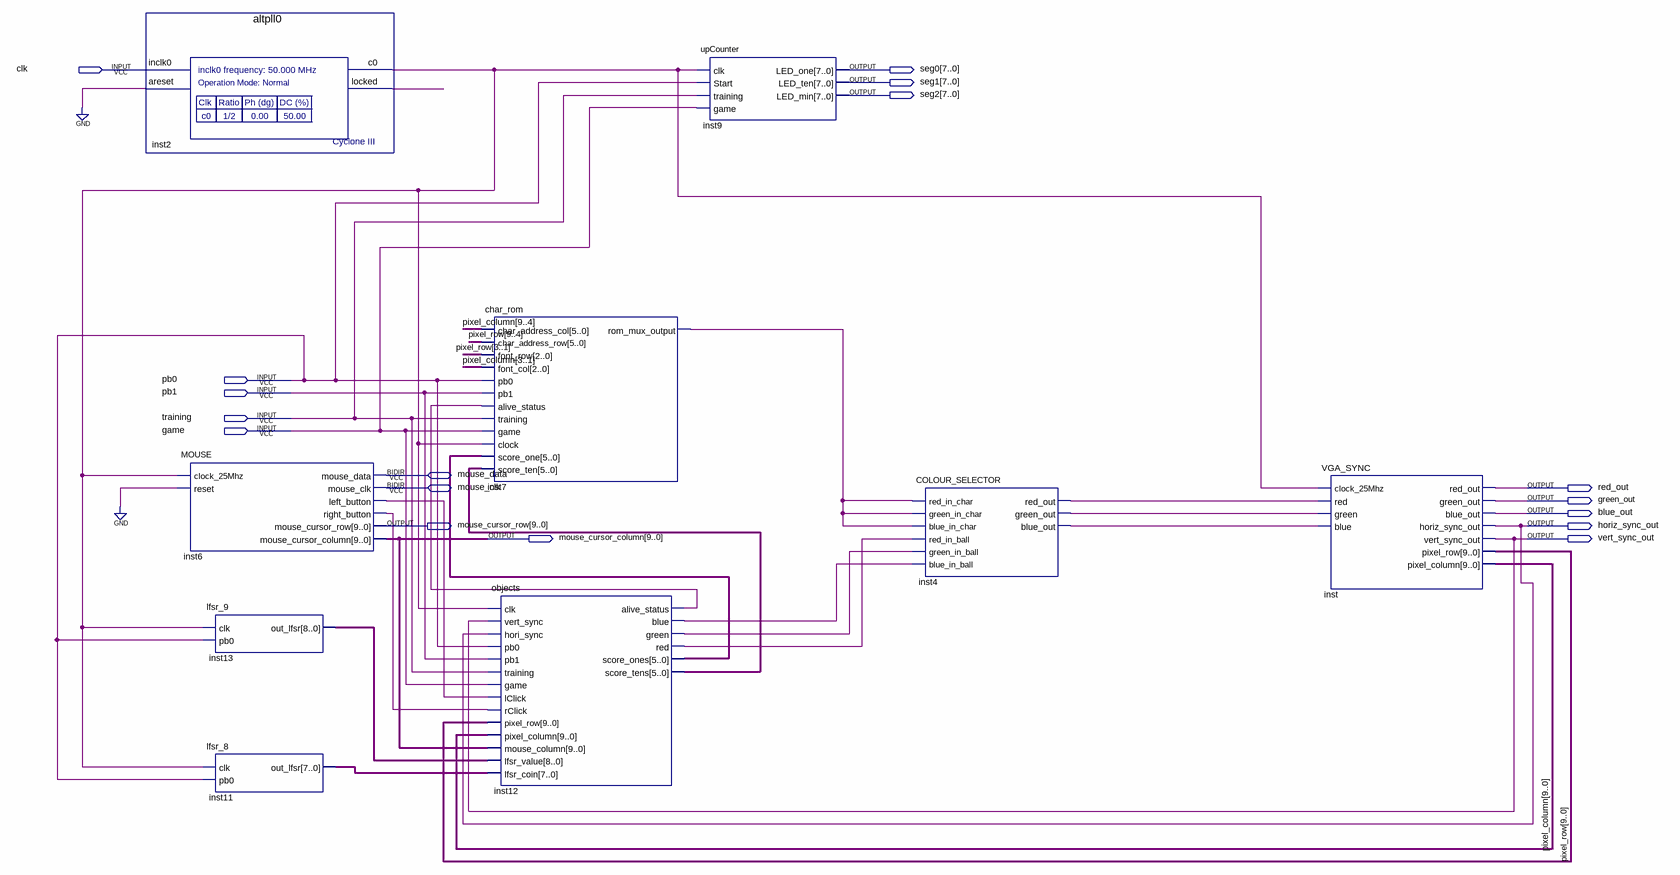
[diagram p0: schematic sheet]
// Quartus schematic miniProject.bdf as structural Verilog: 9 symbols, 17 pins
module miniProject (
  input  clk,
  input  pb0,
  input  pb1,
  input  training,
  input  game,
  inout  mouse_data,
  inout  mouse_clk,
  output [7:0] seg0,
  output [7:0] seg1,
  output [7:0] seg2,
  output red_out,
  output green_out,
  output blue_out,
  output [9:0] mouse_cursor_row,
  output horiz_sync_out,
  output [9:0] mouse_cursor_column,
  output vert_sync_out
);

  wire inst2_c0, inst2_locked, inst4_blue_out, inst4_green_out, inst4_red_out, inst6_left_button,
       inst6_right_button, inst7_rom_mux_output, inst12_alive_status, inst12_blue, inst12_green, inst12_red;
  wire [5:0] inst12_score_ones, inst12_score_tens;
  wire [7:0] inst11_out_lfsr;
  wire [8:0] inst13_out_lfsr;
  wire [9:0] pixel_column, pixel_row;

  altpll0 inst2 (.inclk0(clk), .areset(1'b0), .c0(inst2_c0), .locked(inst2_locked));
  MOUSE inst6 (
    .clock_25Mhz(inst2_c0), .reset(1'b0), .left_button(inst6_left_button), .right_button(inst6_right_button),
    .mouse_cursor_row(mouse_cursor_row), .mouse_cursor_column(mouse_cursor_column), .mouse_data(mouse_data),
    .mouse_clk(mouse_clk));
  lfsr_9 inst13 (.clk(inst2_c0), .pb0(pb0), .out_lfsr(inst13_out_lfsr));
  lfsr_8 inst11 (.clk(inst2_c0), .pb0(pb0), .out_lfsr(inst11_out_lfsr));
  char_rom inst7 (
    .char_address_col(pixel_column[9:4]), .char_address_row(pixel_row[9:4]), .font_row(pixel_row[3:1]),
    .font_col(pixel_column[3:1]), .pb0(pb0), .pb1(pb1), .alive_status(inst12_alive_status),
    .training(training), .game(game), .clock(inst2_c0), .score_one(inst12_score_ones),
    .score_ten(inst12_score_tens), .rom_mux_output(inst7_rom_mux_output));
  objects inst12 (
    .clk(inst2_c0), .vert_sync(vert_sync_out), .hori_sync(horiz_sync_out), .pb0(pb0), .pb1(pb1),
    .training(training), .game(game), .lClick(inst6_left_button), .rClick(inst6_right_button),
    .pixel_row(pixel_row), .pixel_column(pixel_column), .mouse_column(mouse_cursor_column),
    .lfsr_value(inst13_out_lfsr), .lfsr_coin(inst11_out_lfsr), .alive_status(inst12_alive_status),
    .blue(inst12_blue), .green(inst12_green), .red(inst12_red), .score_ones(inst12_score_ones),
    .score_tens(inst12_score_tens));
  upCounter inst9 (
    .clk(inst2_c0), .Start(pb0), .training(training), .game(game), .LED_one(seg0), .LED_ten(seg1),
    .LED_min(seg2));
  COLOUR_SELECTOR inst4 (
    .red_in_char(inst7_rom_mux_output), .green_in_char(inst7_rom_mux_output),
    .blue_in_char(inst7_rom_mux_output), .red_in_ball(inst12_red), .green_in_ball(inst12_green),
    .blue_in_ball(inst12_blue), .red_out(inst4_red_out), .green_out(inst4_green_out),
    .blue_out(inst4_blue_out));
  VGA_SYNC inst (
    .clock_25Mhz(inst2_c0), .red(inst4_red_out), .green(inst4_green_out), .blue(inst4_blue_out),
    .red_out(red_out), .green_out(green_out), .blue_out(blue_out), .horiz_sync_out(horiz_sync_out),
    .vert_sync_out(vert_sync_out), .pixel_row(pixel_row), .pixel_column(pixel_column));
endmodule
